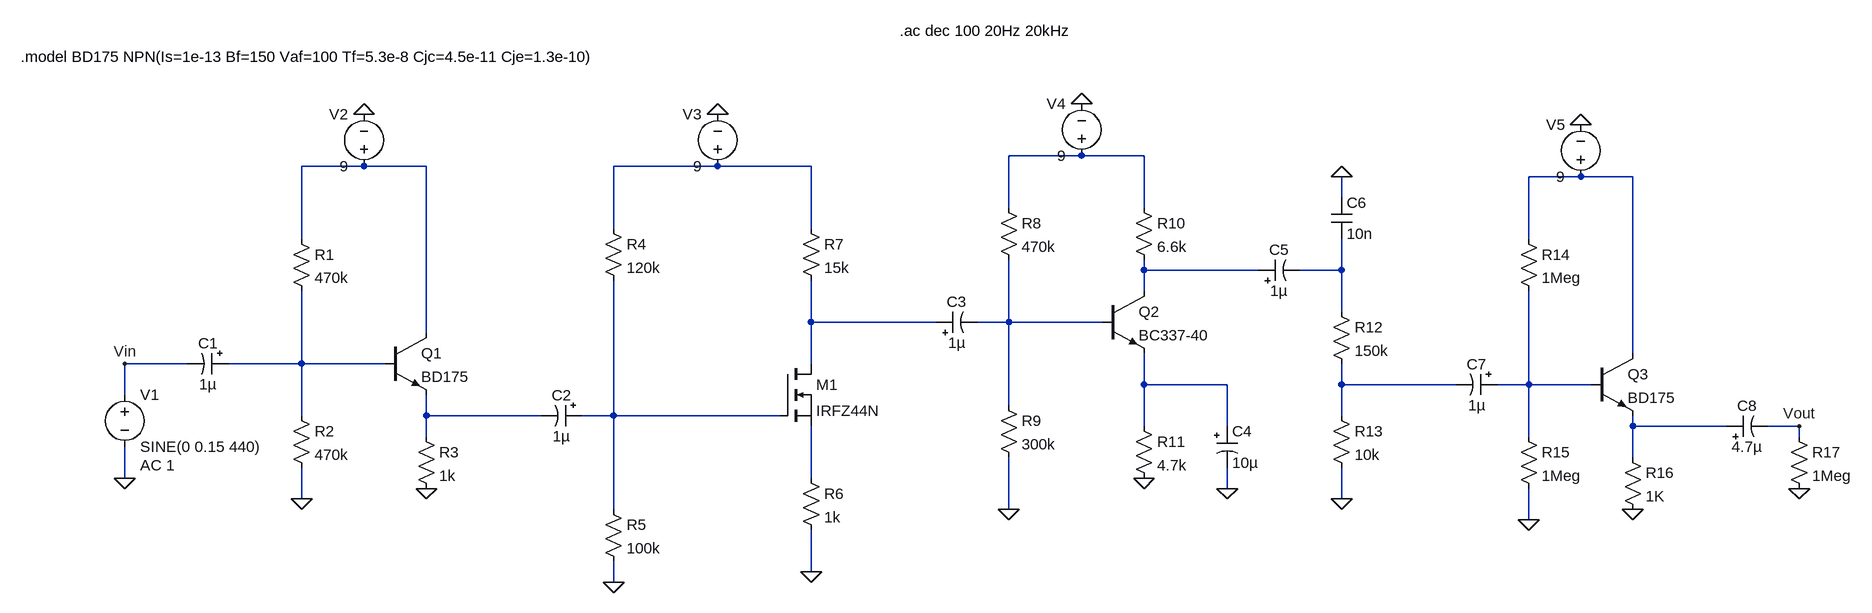
[diagram p0: schematic Distortion Pedal Schematic.asc]
Distortion Pedal Schematic.asc, the LTspice schematic file:
Version 4.1
SHEET 1 2648 680
WIRE 1456 -304 1344 -304
WIRE 1552 -304 1456 -304
WIRE 352 -288 256 -288
WIRE 448 -288 352 -288
WIRE 896 -288 736 -288
WIRE 1040 -288 896 -288
WIRE 2224 -272 2144 -272
WIRE 2304 -272 2224 -272
WIRE 1856 -240 1856 -272
WIRE 1344 -224 1344 -304
WIRE 1552 -224 1552 -304
WIRE 736 -192 736 -288
WIRE 1040 -192 1040 -288
WIRE 256 -176 256 -288
WIRE 2144 -176 2144 -272
WIRE 1552 -128 1552 -144
WIRE 1728 -128 1552 -128
WIRE 1856 -128 1856 -176
WIRE 1856 -128 1792 -128
WIRE 1552 -96 1552 -128
WIRE 1856 -64 1856 -128
WIRE 1040 -48 1040 -112
WIRE 1232 -48 1040 -48
WIRE 1344 -48 1344 -144
WIRE 1344 -48 1296 -48
WIRE 1488 -48 1344 -48
WIRE 448 -32 448 -288
WIRE 2304 0 2304 -272
WIRE 80 16 -16 16
WIRE 256 16 256 -96
WIRE 256 16 144 16
WIRE 384 16 256 16
WIRE 1040 16 1040 -48
WIRE 1552 48 1552 0
WIRE 1680 48 1552 48
WIRE 1856 48 1856 16
WIRE 2032 48 1856 48
WIRE 2144 48 2144 -96
WIRE 2144 48 2096 48
WIRE 2240 48 2144 48
WIRE -16 64 -16 16
WIRE 1344 80 1344 -48
WIRE 256 96 256 16
WIRE 448 96 448 64
WIRE 624 96 448 96
WIRE 736 96 736 -112
WIRE 736 96 688 96
WIRE 992 96 736 96
WIRE 1856 96 1856 48
WIRE 1552 112 1552 48
WIRE 1680 112 1680 48
WIRE 2304 112 2304 96
WIRE 2448 112 2304 112
WIRE 2560 112 2512 112
WIRE 448 128 448 96
WIRE 2144 128 2144 48
WIRE 2560 128 2560 112
WIRE 2304 160 2304 112
WIRE -16 192 -16 144
WIRE 1040 192 1040 112
WIRE 1680 208 1680 176
WIRE 256 224 256 176
WIRE 1856 224 1856 176
WIRE 736 240 736 96
WIRE 1344 240 1344 160
WIRE 2144 256 2144 208
WIRE 1040 336 1040 272
WIRE 736 352 736 320
FLAG -16 192 0
FLAG 256 224 0
FLAG 448 208 0
FLAG 736 352 0
FLAG 1040 336 0
FLAG 1344 240 0
FLAG 1552 192 0
FLAG 1680 208 0
FLAG 1856 -272 0
FLAG 1856 224 0
FLAG 2144 256 0
FLAG 2304 240 0
FLAG 2560 208 0
FLAG 2224 -352 0
FLAG 1456 -384 0
FLAG 896 -368 0
FLAG 352 -368 0
FLAG -16 16 Vin
FLAG 2560 112 Vout
SYMBOL voltage -16 48 R0
WINDOW 123 24 124 Left 2
WINDOW 39 0 0 Left 0
SYMATTR InstName V1
SYMATTR Value SINE(0 0.15 440)
SYMATTR Value2 AC 1
SYMBOL polcap 144 0 R90
WINDOW 0 0 32 VBottom 2
WINDOW 3 32 32 VTop 2
SYMATTR InstName C1
SYMATTR Value 1µ
SYMBOL res 240 -192 R0
SYMATTR InstName R1
SYMATTR Value 470k
SYMBOL res 240 80 R0
SYMATTR InstName R2
SYMATTR Value 470k
SYMBOL npn 384 -32 R0
SYMATTR InstName Q1
SYMATTR Value BD175
SYMBOL res 432 112 R0
SYMATTR InstName R3
SYMATTR Value 1k
SYMBOL polcap 688 80 R90
WINDOW 0 0 32 VBottom 2
WINDOW 3 32 32 VTop 2
SYMATTR InstName C2
SYMATTR Value 1µ
SYMBOL res 720 -208 R0
SYMATTR InstName R4
SYMATTR Value 120k
SYMBOL res 720 224 R0
SYMATTR InstName R5
SYMATTR Value 100k
SYMBOL nmos 992 16 R0
SYMATTR InstName M1
SYMATTR Value IRFZ44N
SYMBOL res 1024 176 R0
SYMATTR InstName R6
SYMATTR Value 1k
SYMBOL res 1024 -208 R0
SYMATTR InstName R7
SYMATTR Value 15k
SYMBOL polcap 1232 -32 R270
WINDOW 0 32 32 VTop 2
WINDOW 3 0 32 VBottom 2
SYMATTR InstName C3
SYMATTR Value 1µ
SYMBOL res 1328 -240 R0
SYMATTR InstName R8
SYMATTR Value 470k
SYMBOL res 1328 64 R0
SYMATTR InstName R9
SYMATTR Value 300k
SYMBOL res 1536 -240 R0
SYMATTR InstName R10
SYMATTR Value 6.6k
SYMBOL npn 1488 -96 R0
SYMATTR InstName Q2
SYMATTR Value BC337-40
SYMBOL res 1536 96 R0
SYMATTR InstName R11
SYMATTR Value 4.7k
SYMBOL polcap 1664 112 R0
SYMATTR InstName C4
SYMATTR Value 10µ
SYMBOL polcap 1728 -112 R270
WINDOW 0 32 32 VTop 2
WINDOW 3 0 32 VBottom 2
SYMATTR InstName C5
SYMATTR Value 1µ
SYMBOL cap 1840 -240 R0
SYMATTR InstName C6
SYMATTR Value 10n
SYMBOL res 1840 -80 R0
SYMATTR InstName R12
SYMATTR Value 150k
SYMBOL res 1840 80 R0
SYMATTR InstName R13
SYMATTR Value 10k
SYMBOL polcap 2096 32 R90
WINDOW 0 0 32 VBottom 2
WINDOW 3 32 32 VTop 2
SYMATTR InstName C7
SYMATTR Value 1µ
SYMBOL res 2128 -192 R0
SYMATTR InstName R14
SYMATTR Value 1Meg
SYMBOL res 2128 112 R0
SYMATTR InstName R15
SYMATTR Value 1Meg
SYMBOL npn 2240 0 R0
SYMATTR InstName Q3
SYMATTR Value BD175
SYMBOL res 2288 144 R0
SYMATTR InstName R16
SYMATTR Value 1K
SYMBOL polcap 2448 128 R270
WINDOW 0 32 32 VTop 2
WINDOW 3 0 32 VBottom 2
SYMATTR InstName C8
SYMATTR Value 4.7µ
SYMBOL res 2544 112 R0
SYMATTR InstName R17
SYMATTR Value 1Meg
SYMBOL voltage 352 -272 R180
WINDOW 0 24 96 Left 2
WINDOW 3 24 16 Left 2
WINDOW 123 0 0 Left 0
WINDOW 39 0 0 Left 0
SYMATTR InstName V2
SYMATTR Value 9
SYMBOL voltage 896 -272 R180
WINDOW 0 24 96 Left 2
WINDOW 3 24 16 Left 2
WINDOW 123 0 0 Left 0
WINDOW 39 0 0 Left 0
SYMATTR InstName V3
SYMATTR Value 9
SYMBOL voltage 1456 -288 R180
WINDOW 0 24 96 Left 2
WINDOW 3 24 16 Left 2
SYMATTR InstName V4
SYMATTR Value 9
SYMBOL voltage 2224 -256 R180
WINDOW 0 24 96 Left 2
WINDOW 3 24 16 Left 2
WINDOW 123 0 0 Left 0
WINDOW 39 0 0 Left 0
SYMATTR InstName V5
SYMATTR Value 9
TEXT -176 -456 Left 2 !.model BD175 NPN(Is=1e-13 Bf=150 Vaf=100 Tf=5.3e-8 Cjc=4.5e-11 Cje=1.3e-10)
TEXT 1176 -496 Left 2 !.ac dec 100 20Hz 20kHz

The netlist it stands for:
* Distortion Pedal Schematic.asc
V1 Vin 0 SINE(0 0.15 440) AC 1
C1 N009 Vin 1µ
R1 N002 N009 470k
R2 N009 0 470k
Q1 N002 N009 N013 0 BD175
R3 N013 0 1k
C2 N014 N013 1µ
R4 N003 N014 120k
R5 N014 0 100k
M1 N007 N014 N016 N016 IRFZ44N
R6 N016 0 1k
R7 N003 N007 15k
C3 N007 N008 1µ
R8 N001 N008 470k
R9 N008 0 300k
R10 N001 N005 6.6k
Q2 N005 N008 N010 0 BC337-40
R11 N010 0 4.7k
C4 N010 0 10µ
C5 N005 N006 1µ
C6 0 N006 10n
R12 N006 N011 150k
R13 N011 0 10k
C7 N012 N011 1µ
R14 N004 N012 1Meg
R15 N012 0 1Meg
Q3 N004 N012 N015 0 BD175
R16 N015 0 1K
C8 N015 Vout 4.7µ
R17 Vout 0 1Meg
V2 N002 0 9
V3 N003 0 9
V4 N001 0 9
V5 N004 0 9
.model NPN NPN
.model PNP PNP
.lib standard.bjt
.model NMOS NMOS
.model PMOS PMOS
.lib standard.mos
.model BD175 NPN(Is=1e-13 Bf=150 Vaf=100 Tf=5.3e-8 Cjc=4.5e-11 Cje=1.3e-10)
.ac dec 100 20Hz 20kHz
.backanno
.end